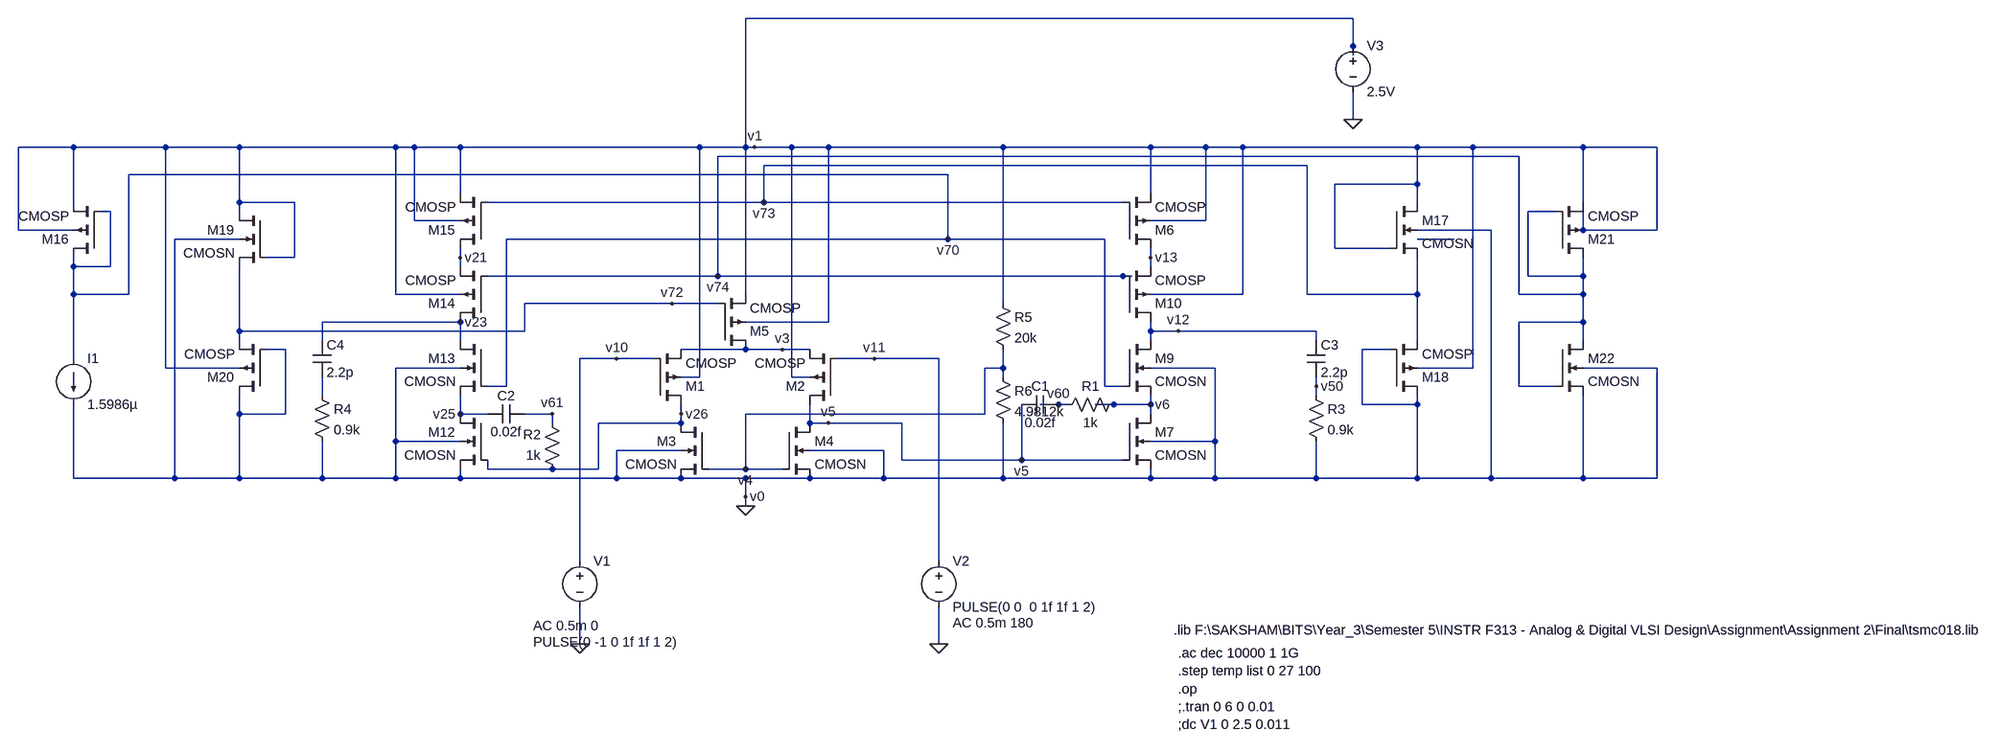
[diagram p0: schematic Circuit.asc]
Circuit.asc, the LTspice schematic file:
Version 4
SHEET 1 2412 744
WIRE 1264 -528 208 -528
WIRE 1264 -480 1264 -528
WIRE 1264 -464 1264 -480
WIRE 1264 -352 1264 -400
WIRE -960 -304 -1056 -304
WIRE -800 -304 -960 -304
WIRE -672 -304 -800 -304
WIRE -400 -304 -672 -304
WIRE -368 -304 -400 -304
WIRE -288 -304 -368 -304
WIRE 128 -304 -288 -304
WIRE 208 -304 208 -528
WIRE 208 -304 128 -304
WIRE 224 -304 208 -304
WIRE 288 -304 224 -304
WIRE 352 -304 288 -304
WIRE 656 -304 352 -304
WIRE 912 -304 656 -304
WIRE 1008 -304 912 -304
WIRE 1072 -304 1008 -304
WIRE 1376 -304 1072 -304
WIRE 1472 -304 1376 -304
WIRE 1664 -304 1472 -304
WIRE 1792 -304 1664 -304
WIRE 1552 -288 160 -288
WIRE 1184 -272 240 -272
WIRE 560 -256 -864 -256
WIRE 1376 -240 1376 -304
WIRE 1376 -240 1232 -240
WIRE -288 -224 -288 -304
WIRE 912 -224 912 -304
WIRE -960 -208 -960 -304
WIRE -672 -208 -672 -304
WIRE -576 -208 -672 -208
WIRE 240 -208 240 -272
WIRE 240 -208 -240 -208
WIRE 864 -208 240 -208
WIRE 1376 -208 1376 -240
WIRE 1664 -208 1664 -304
WIRE -896 -192 -912 -192
WIRE -672 -192 -672 -208
WIRE 1616 -192 1568 -192
WIRE -368 -176 -368 -304
WIRE -288 -176 -368 -176
WIRE 1008 -176 1008 -304
WIRE 1008 -176 912 -176
WIRE -1056 -160 -1056 -304
WIRE -960 -160 -1056 -160
WIRE 1504 -160 1376 -160
WIRE 1664 -160 1664 -192
WIRE 1792 -160 1792 -304
WIRE 1792 -160 1664 -160
WIRE -672 -144 -784 -144
WIRE 560 -144 560 -256
WIRE 560 -144 -208 -144
WIRE 832 -144 560 -144
WIRE 1440 -144 1376 -144
WIRE 1232 -128 1232 -240
WIRE 1328 -128 1232 -128
WIRE -576 -112 -576 -208
WIRE -576 -112 -624 -112
WIRE -288 -112 -288 -128
WIRE 912 -112 912 -128
WIRE -960 -96 -960 -112
WIRE -896 -96 -896 -192
WIRE -896 -96 -960 -96
WIRE -288 -96 -288 -112
WIRE 912 -96 912 -112
WIRE 160 -80 160 -288
WIRE 160 -80 -240 -80
WIRE 864 -80 160 -80
WIRE 880 -80 864 -80
WIRE 1568 -80 1568 -192
WIRE 1664 -80 1664 -112
WIRE 1664 -80 1568 -80
WIRE -960 -48 -960 -96
WIRE -864 -48 -864 -256
WIRE -864 -48 -960 -48
WIRE -400 -48 -400 -304
WIRE -288 -48 -400 -48
WIRE 208 -48 208 -304
WIRE 1072 -48 1072 -304
WIRE 1072 -48 912 -48
WIRE 1184 -48 1184 -272
WIRE 1376 -48 1376 -112
WIRE 1376 -48 1184 -48
WIRE 1552 -48 1552 -288
WIRE 1664 -48 1664 -80
WIRE 1664 -48 1552 -48
WIRE 80 -32 -176 -32
WIRE 160 -32 80 -32
WIRE 656 -32 656 -304
WIRE -288 0 -528 0
WIRE 352 0 352 -304
WIRE 352 0 208 0
WIRE 1664 0 1664 -48
WIRE 1664 0 1552 0
WIRE -672 16 -672 -96
WIRE -176 16 -176 -32
WIRE -176 16 -672 16
WIRE 912 16 912 0
WIRE 960 16 912 16
WIRE 1200 16 960 16
WIRE -672 32 -672 16
WIRE -528 32 -528 0
WIRE -288 32 -288 0
WIRE 912 32 912 16
WIRE 1200 32 1200 16
WIRE 1376 32 1376 -48
WIRE 1664 32 1664 0
WIRE -592 48 -624 48
WIRE 208 48 96 48
WIRE 272 48 208 48
WIRE 320 48 272 48
WIRE 1328 48 1280 48
WIRE -960 64 -960 -48
WIRE -16 64 -80 64
WIRE 48 64 -16 64
WIRE 432 64 368 64
WIRE 544 64 432 64
WIRE -800 80 -800 -304
WIRE -672 80 -800 80
WIRE -288 80 -400 80
WIRE 656 80 656 48
WIRE 656 80 624 80
WIRE 1024 80 912 80
WIRE 1472 80 1472 -304
WIRE 1472 80 1376 80
WIRE 1792 80 1664 80
WIRE 128 96 128 -304
WIRE 128 96 96 96
WIRE 288 96 288 -304
WIRE 320 96 288 96
WIRE 656 96 656 80
WIRE -208 112 -208 -144
WIRE -208 112 -240 112
WIRE 832 112 832 -144
WIRE 864 112 832 112
WIRE 1200 112 1200 96
WIRE 1552 112 1552 0
WIRE 1616 112 1552 112
WIRE -528 128 -528 96
WIRE 1200 128 1200 112
WIRE 752 144 720 144
WIRE 768 144 752 144
WIRE 848 144 816 144
WIRE 912 144 912 128
WIRE 912 144 848 144
WIRE 1280 144 1280 48
WIRE 1376 144 1376 128
WIRE 1376 144 1280 144
WIRE -672 160 -672 128
WIRE -592 160 -592 48
WIRE -592 160 -672 160
WIRE -288 160 -288 128
WIRE -240 160 -288 160
WIRE -128 160 -176 160
WIRE 96 160 96 144
WIRE 624 160 624 80
WIRE 624 160 208 160
WIRE 912 160 912 144
WIRE -128 176 -128 160
WIRE 96 176 96 160
WIRE 96 176 -48 176
WIRE 320 176 320 144
WIRE 352 176 320 176
WIRE 480 176 352 176
WIRE -400 208 -400 80
WIRE -288 208 -400 208
WIRE 1024 208 1024 80
WIRE 1024 208 912 208
WIRE 96 224 -16 224
WIRE 448 224 320 224
WIRE 480 240 480 176
WIRE 688 240 688 144
WIRE 688 240 480 240
WIRE 864 240 688 240
WIRE -240 256 -240 240
WIRE -128 256 -240 256
WIRE -48 256 -48 176
WIRE -48 256 -128 256
WIRE 208 256 208 160
WIRE 208 256 144 256
WIRE 272 256 208 256
WIRE -960 272 -960 144
WIRE -784 272 -784 -144
WIRE -784 272 -960 272
WIRE -672 272 -672 160
WIRE -672 272 -784 272
WIRE -528 272 -528 208
WIRE -528 272 -672 272
WIRE -400 272 -400 208
WIRE -400 272 -528 272
WIRE -288 272 -288 256
WIRE -288 272 -400 272
WIRE -16 272 -16 224
WIRE -16 272 -288 272
WIRE 96 272 -16 272
WIRE 208 272 96 272
WIRE 320 272 208 272
WIRE 448 272 448 224
WIRE 448 272 320 272
WIRE 656 272 656 176
WIRE 656 272 448 272
WIRE 912 272 912 256
WIRE 912 272 656 272
WIRE 1024 272 1024 208
WIRE 1024 272 912 272
WIRE 1200 272 1200 208
WIRE 1200 272 1024 272
WIRE 1376 272 1376 144
WIRE 1376 272 1200 272
WIRE 1504 272 1504 -160
WIRE 1504 272 1376 272
WIRE 1664 272 1664 128
WIRE 1664 272 1504 272
WIRE 1792 272 1792 80
WIRE 1792 272 1664 272
WIRE 208 304 208 272
WIRE 208 320 208 304
WIRE -80 416 -80 64
WIRE 544 416 544 64
WIRE -80 560 -80 496
WIRE 544 560 544 496
FLAG 208 320 0
FLAG 1264 -352 0
FLAG 544 560 0
FLAG -80 560 0
FLAG 960 16 v12
FLAG 272 48 v3
FLAG 80 -32 v72
FLAG 96 160 v26
FLAG -16 64 v10
FLAG 224 -304 v1
FLAG 352 176 v5
FLAG 432 64 v11
FLAG 208 256 v4
FLAG 912 -112 v13
FLAG 912 144 v6
FLAG 688 240 v5
FLAG 560 -144 v70
FLAG -288 -112 v21
FLAG -288 0 v23
FLAG -288 160 v25
FLAG 752 144 v60
FLAG -128 160 v61
FLAG 1200 112 v50
FLAG 208 304 v0
FLAG 240 -208 v73
FLAG 160 -80 v74
SYMBOL pmos4 48 144 M180
SYMATTR InstName M1
SYMATTR Value CMOSP
SYMATTR Value2 l=350n w=122500n
SYMBOL pmos4 368 144 R180
SYMATTR InstName M2
SYMATTR Value CMOSP
SYMATTR Value2 l=350n w=122500n
SYMBOL pmos4 160 48 M180
SYMATTR InstName M5
SYMATTR Value CMOSP
SYMATTR Value2 l=350n w=1750n
SYMBOL voltage -80 400 R0
WINDOW 3 -81 157 Left 2
WINDOW 123 -81 129 Left 2
WINDOW 39 0 0 Left 2
SYMATTR Value PULSE(0 -1 0 1f 1f 1 2)
SYMATTR Value2 AC 0.5m 0
SYMATTR InstName V1
SYMBOL voltage 544 400 R0
WINDOW 123 24 124 Left 2
WINDOW 39 0 0 Left 2
SYMATTR Value2 AC 0.5m 180
SYMATTR InstName V2
SYMATTR Value PULSE(0 0  0 1f 1f 1 2)
SYMBOL pmos4 864 -128 M180
SYMATTR InstName M6
SYMATTR Value CMOSP
SYMATTR Value2 l=350n w=3300n
SYMBOL pmos4 864 0 M180
SYMATTR InstName M10
SYMATTR Value CMOSP
SYMATTR Value2 l=350n w=3300n
SYMBOL pmos4 -240 0 R180
SYMATTR InstName M14
SYMATTR Value CMOSP
SYMATTR Value2 l=350n w=3300n
SYMBOL pmos4 -240 -128 R180
SYMATTR InstName M15
SYMATTR Value CMOSP
SYMATTR Value2 l=350n w=3300n
SYMBOL nmos4 144 176 M0
SYMATTR InstName M3
SYMATTR Value CMOSN
SYMATTR Value2 l=350n w=35000n
SYMBOL nmos4 272 176 R0
SYMATTR InstName M4
SYMATTR Value CMOSN
SYMATTR Value2 l=350n w=35000n
SYMBOL nmos4 864 160 R0
SYMATTR InstName M7
SYMATTR Value CMOSN
SYMATTR Value2 l=350n w=70000n
SYMBOL nmos4 864 32 R0
SYMATTR InstName M9
SYMATTR Value CMOSN
SYMATTR Value2 l=350n w=2000n
SYMBOL nmos4 -240 160 M0
SYMATTR InstName M12
SYMATTR Value CMOSN
SYMATTR Value2 l=350n w=70000n
SYMBOL nmos4 -240 32 M0
SYMATTR InstName M13
SYMATTR Value CMOSN
SYMATTR Value2 l=350n w=2000n
SYMBOL cap 752 128 R90
WINDOW 0 0 32 VBottom 2
WINDOW 3 32 32 VTop 2
SYMATTR InstName C1
SYMATTR Value 0.02f
SYMBOL cap -176 144 R90
WINDOW 0 0 32 VBottom 2
WINDOW 3 32 32 VTop 2
SYMATTR InstName C2
SYMATTR Value 0.02f
SYMBOL res 864 128 R90
WINDOW 0 0 56 VBottom 2
WINDOW 3 32 56 VTop 2
SYMATTR InstName R1
SYMATTR Value 1k
SYMBOL res -112 272 R180
WINDOW 0 36 76 Left 2
WINDOW 3 36 40 Left 2
SYMATTR InstName R2
SYMATTR Value 1k
SYMBOL cap 1184 32 R0
SYMATTR InstName C3
SYMATTR Value 2.2p
SYMBOL cap -544 32 R0
SYMATTR InstName C4
SYMATTR Value 2.2p
SYMBOL pmos4 -912 -112 R180
SYMATTR InstName M16
SYMATTR Value CMOSP
SYMATTR Value2 l=350n w=350n
SYMBOL nmos4 1328 -208 R0
SYMATTR InstName M17
SYMATTR Value CMOSN
SYMATTR Value2 l=350n w=1920n
SYMBOL pmos4 1328 128 M180
SYMATTR InstName M18
SYMATTR Value CMOSP
SYMATTR Value2 l=350n w=350n
SYMBOL nmos4 -624 -192 M0
SYMATTR InstName M19
SYMATTR Value CMOSN
SYMATTR Value2 l=350n w=877n
SYMBOL pmos4 -624 128 R180
SYMATTR InstName M20
SYMATTR Value CMOSP
SYMATTR Value2 l=350n w=350n
SYMBOL pmos4 1616 -112 M180
SYMATTR InstName M21
SYMATTR Value CMOSP
SYMATTR Value2 l=350n w=573n
SYMBOL current -960 64 R0
WINDOW 123 0 0 Left 2
WINDOW 39 0 0 Left 2
SYMATTR InstName I1
SYMATTR Value 1.5986µ
SYMBOL nmos4 1616 32 R0
SYMATTR InstName M22
SYMATTR Value CMOSN
SYMATTR Value2 l=350n w=350n
SYMBOL res 1184 112 R0
SYMATTR InstName R3
SYMATTR Value 0.9k
SYMBOL res -544 112 R0
SYMATTR InstName R4
SYMATTR Value 0.9k
SYMBOL res 640 -48 R0
SYMATTR InstName R5
SYMATTR Value 20k
SYMBOL res 640 80 R0
SYMATTR InstName R6
SYMATTR Value 4.9812k
SYMBOL voltage 1264 -496 R0
WINDOW 123 0 0 Left 2
WINDOW 39 0 0 Left 2
SYMATTR InstName V3
SYMATTR Value 2.5V
TEXT 952 536 Left 2 !.lib F:\\SAKSHAM\\BITS\\Year_3\\Semester 5\\INSTR F313 - Analog & Digital VLSI Design\\Assignment\\Assignment 2\\Final\\tsmc018.lib
TEXT 960 576 Left 2 !.ac dec 10000 1 1G\n.step temp list 0 27 100\n.op\n;.tran 0 6 0 0.01\n;dc V1 0 2.5 0.011

The netlist it stands for:
* Circuit.asc
M1 v26 v10 v3 v1 CMOSP l=350n w=122500n
M2 v5 v11 v3 v1 CMOSP l=350n w=122500n
M5 v3 v72 v1 v1 CMOSP l=350n w=1750n
V1 v10 0 PULSE(0 -1 0 1f 1f 1 2) AC 0.5m 0
V2 v11 0 PULSE(0 0  0 1f 1f 1 2) AC 0.5m 180
M6 v13 v73 v1 v1 CMOSP l=350n w=3300n
M10 v12 v74 v13 v1 CMOSP l=350n w=3300n
M14 v23 v74 v21 v1 CMOSP l=350n w=3300n
M15 v21 v73 v1 v1 CMOSP l=350n w=3300n
M3 v26 v4 0 0 CMOSN l=350n w=35000n
M4 v5 v4 0 0 CMOSN l=350n w=35000n
M7 v6 v5 0 0 CMOSN l=350n w=70000n
M9 v12 v70 v6 0 CMOSN l=350n w=2000n
M12 v25 v26 0 0 CMOSN l=350n w=70000n
M13 v23 v70 v25 0 CMOSN l=350n w=2000n
C1 v60 v5 0.02f
C2 v61 v25 0.02f
R1 v6 v60 1k
R2 v26 v61 1k
C3 v12 v50 2.2p
C4 v23 N002 2.2p
M16 v70 v70 v1 v1 CMOSP l=350n w=350n
M17 v1 v1 v73 0 CMOSN l=350n w=1920n
M18 0 0 v73 v1 CMOSP l=350n w=350n
M19 v1 v1 v72 0 CMOSN l=350n w=877n
M20 0 0 v72 v1 CMOSP l=350n w=350n
M21 v74 v74 v1 v1 CMOSP l=350n w=573n
I1 v70 0 1.5986µ
M22 v74 v74 0 0 CMOSN l=350n w=350n
R3 v50 0 0.9k
R4 N002 0 0.9k
R5 v1 v4 20k
R6 v4 0 4.9812k
V3 v1 0 2.5V
.model NMOS NMOS
.model PMOS PMOS
.lib standard.mos
.lib F:\SAKSHAM\BITS\Year_3\Semester 5\INSTR F313 - Analog & Digital VLSI Design\Assignment\Assignment 2\Final\tsmc018.lib
.ac dec 10000 1 1G
.step temp list 0 27 100
.op
;.tran 0 6 0 0.01
;dc V1 0 2.5 0.011
.backanno
.end

* Results of the author's LTspice run, read from the files saved beside the schematic
* Operating Point (first step), zero values left out:
*   V(v26) = 1.993 V
*   V(v3) = 1.993 V
*   V(v1) = 2.5 V
*   V(v5) = 1.993 V
*   V(v72) = 1.426 V
*   V(v13) = 2.104 V
*   V(v73) = 1.483 V
*   V(v12) = 52.03 mV
*   V(v74) = 1.115 V
*   V(v23) = 52.03 mV
*   V(v21) = 2.104 V
*   V(v4) = 498.5 mV
*   V(v6) = 1.336 mV
*   V(v70) = 1.789 V
*   V(v25) = 1.336 mV
*   V(v60) = 1.336 mV
*   V(v61) = 1.993 V
*   Id(M22) = 38.88 µA
*   Ib(M22) = -1.125 pA
*   Is(M22) = -38.88 µA
*   Id(M19) = 16.19 µA
*   Ib(M19) = -3.946 pA
*   Is(M19) = -16.19 µA
*   Id(M17) = 18.94 µA
*   Ib(M17) = -4.003 pA
*   Is(M17) = -18.94 µA
*   Id(M13) = 70.68 µA
*   Is(M13) = -70.68 µA
*   Id(M12) = 70.68 µA
*   Is(M12) = -70.68 µA
*   Id(M9) = 70.68 µA
*   Is(M9) = -70.68 µA
*   Id(M7) = 70.68 µA
*   Is(M7) = -70.68 µA
*   Id(M4) = 23.47 µA
*   Ib(M4) = -2.003 pA
*   Is(M4) = -23.47 µA
*   Id(M3) = 23.47 µA
*   Ib(M3) = -2.003 pA
*   Is(M3) = -23.47 µA
*   Id(M21) = -38.88 µA
*   Ib(M21) = 1.395 pA
*   Is(M21) = 38.88 µA
*   Id(M20) = -16.19 µA
*   Ib(M20) = 3.594 pA
*   Is(M20) = 16.19 µA
*   Id(M18) = -18.94 µA
*   Ib(M18) = 3.537 pA
*   Is(M18) = 18.94 µA
*   Id(M16) = -1.599 µA
*   Is(M16) = 1.599 µA
*   Id(M15) = -70.68 µA
*   Is(M15) = 70.68 µA
*   Id(M14) = -70.68 µA
*   Ib(M14) = 2.864 pA
*   Is(M14) = 70.68 µA
*   Id(M10) = -70.68 µA
*   Ib(M10) = 2.864 pA
*   Is(M10) = 70.68 µA
*   Id(M6) = -70.68 µA
*   Is(M6) = 70.68 µA
*   Id(M5) = -46.95 µA
*   Is(M5) = 46.95 µA
*   Id(M2) = -23.47 µA
*   Ib(M2) = 1.034 pA
*   Is(M2) = 23.47 µA
*   Id(M1) = -23.47 µA
*   Ib(M1) = 1.034 pA
*   Is(M1) = 23.47 µA
*   I(I1) = 1.599 µA
*   I(R6) = 100.1 µA
*   I(R5) = 100.1 µA
*   I(V3) = -364 µA
* From the log:
*   Semiconductor Device Operating Points:
*                           --- BSIM3 MOSFETS ---
*   Name:        m22         m19         m17         m13         m12
*   Model:      cmosn       cmosn       cmosn       cmosn       cmosn
*   Id:        3.89e-05    1.62e-05    1.89e-05    7.07e-05    7.07e-05
*   Vgs:       1.12e+00    1.07e+00    1.02e+00    1.79e+00    1.99e+00
*   Vds:       1.12e+00    1.07e+00    1.02e+00    5.07e-02    1.34e-03
*   Vbs:       0.00e+00   -1.43e+00   -1.48e+00   -1.34e-03    0.00e+00
*   Vth:       5.60e-01    8.72e-01    8.82e-01    5.63e-01    5.62e-01
*   Vdsat:     4.09e-01    1.90e-01    1.42e-01    8.03e-01    9.22e-01
*   Gm:        1.02e-04    1.23e-04    2.01e-04    2.22e-05    1.33e-05
*   Gds:       3.93e-06    2.84e-06    3.96e-06    1.35e-03    5.29e-02
*   Gmb        3.47e-05    2.52e-05    3.93e-05    2.28e-05    2.04e-05
*   Cbd:       0.00e+00    0.00e+00    0.00e+00    0.00e+00    0.00e+00
*   Cbs:       0.00e+00    0.00e+00    0.00e+00    0.00e+00    0.00e+00
*   Cgsov:     1.91e-16    4.78e-16    1.05e-15    1.09e-15    3.82e-14
*   Cgdov:     1.89e-16    4.73e-16    1.04e-15    1.09e-15    3.82e-14
*   Cgbov:     0.00e+00    0.00e+00    0.00e+00    0.00e+00    0.00e+00
*   dQgdVgb:   1.05e-15    2.62e-15    5.71e-15    6.77e-15    2.37e-13
*   dQgdVdb:  -1.88e-16   -4.70e-16   -1.03e-15   -3.27e-15   -1.17e-13
*   dQgdVsb:  -8.19e-16   -2.07e-15   -4.50e-15   -3.46e-15   -1.18e-13
*   dQddVgb:  -1.90e-16   -4.74e-16   -1.04e-15   -3.37e-15   -1.18e-13
*   dQddVdb:   1.89e-16    4.73e-16    1.04e-15    7.36e-15    2.66e-13
*   dQddVsb:   3.53e-19    8.30e-19    1.97e-18   -3.36e-15   -1.24e-13
*   dQbdVgb:  -1.31e-16   -3.16e-16   -6.92e-16   -1.28e-17   -2.64e-16
*   dQbdVdb:  -5.89e-20   -9.65e-20   -1.64e-19   -2.00e-15   -7.25e-14
*   dQbdVsb:  -6.66e-17   -5.53e-18   -2.34e-18    6.59e-16    2.49e-14
*   Name:        m9          m7          m4          m3          m21
*   Model:      cmosn       cmosn       cmosn       cmosn       cmosp
*   Id:        7.07e-05    7.07e-05    2.35e-05    2.35e-05   -3.89e-05
*   Vgs:       1.79e+00    1.99e+00    4.98e-01    4.98e-01   -1.38e+00
*   Vds:       5.07e-02    1.34e-03    1.99e+00    1.99e+00   -1.38e+00
*   Vbs:      -1.34e-03    0.00e+00    0.00e+00    0.00e+00    0.00e+00
*   Vth:       5.63e-01    5.62e-01    5.58e-01    5.58e-01   -5.14e-01
*   Vdsat:     8.03e-01    9.22e-01    4.73e-02    4.73e-02   -5.12e-01
*   Gm:        2.22e-05    1.33e-05    5.30e-04    5.30e-04    6.71e-05
*   Gds:       1.35e-03    5.29e-02    6.66e-06    6.66e-06    7.84e-06
*   Gmb        2.28e-05    2.04e-05    1.57e-04    1.57e-04    1.66e-05
*   Cbd:       0.00e+00    0.00e+00    0.00e+00    0.00e+00    0.00e+00
*   Cbs:       0.00e+00    0.00e+00    0.00e+00    0.00e+00    0.00e+00
*   Cgsov:     1.09e-15    3.82e-14    1.91e-14    1.91e-14    3.12e-16
*   Cgdov:     1.09e-15    3.82e-14    1.67e-14    1.67e-14    3.09e-16
*   Cgbov:     0.00e+00    0.00e+00    0.00e+00    0.00e+00    0.00e+00
*   dQgdVgb:   6.77e-15    2.37e-13    6.04e-14    6.04e-14    1.77e-15
*   dQgdVdb:  -3.27e-15   -1.17e-13   -1.67e-14   -1.67e-14   -3.09e-16
*   dQgdVsb:  -3.46e-15   -1.18e-13   -2.58e-14   -2.58e-14   -1.41e-15
*   dQddVgb:  -3.37e-15   -1.18e-13   -1.67e-14   -1.67e-14   -3.09e-16
*   dQddVdb:   7.36e-15    2.66e-13    1.67e-14    1.67e-14    3.09e-16
*   dQddVsb:  -3.36e-15   -1.24e-13    1.10e-18    1.10e-18    2.12e-19
*   dQbdVgb:  -1.28e-17   -2.64e-16   -1.87e-14   -1.87e-14   -2.50e-16
*   dQbdVdb:  -2.00e-15   -7.25e-14    1.34e-18    1.34e-18   -3.10e-19
*   dQbdVsb:   6.59e-16    2.49e-14   -9.40e-16   -9.40e-16   -4.79e-17
*   Name:        m20         m18         m16         m15         m14
*   Model:      cmosp       cmosp       cmosp       cmosp       cmosp
*   Id:       -1.62e-05   -1.89e-05   -1.60e-06   -7.07e-05   -7.07e-05
*   Vgs:      -1.43e+00   -1.48e+00   -7.11e-01   -1.02e+00   -9.88e-01
*   Vds:      -1.43e+00   -1.48e+00   -7.11e-01   -3.96e-01   -2.05e+00
*   Vbs:       1.07e+00    1.02e+00    0.00e+00    0.00e+00    3.96e-01
*   Vth:      -7.39e-01   -7.29e-01   -5.14e-01   -5.14e-01   -6.09e-01
*   Vdsat:    -4.62e-01   -4.97e-01   -1.51e-01   -3.30e-01   -2.75e-01
*   Gm:        3.64e-05    3.82e-05    1.55e-05    2.28e-04    3.00e-04
*   Gds:       3.22e-06    3.60e-06    5.92e-07    3.86e-05    1.53e-05
*   Gmb        7.23e-06    7.79e-06    3.85e-06    5.65e-05    6.69e-05
*   Cbd:       0.00e+00    0.00e+00    0.00e+00    0.00e+00    0.00e+00
*   Cbs:       0.00e+00    0.00e+00    0.00e+00    0.00e+00    0.00e+00
*   Cgsov:     1.91e-16    1.91e-16    1.91e-16    1.80e-15    1.80e-15
*   Cgdov:     1.88e-16    1.88e-16    1.88e-16    1.80e-15    1.61e-15
*   Cgbov:     0.00e+00    0.00e+00    0.00e+00    0.00e+00    0.00e+00
*   dQgdVgb:   1.07e-15    1.07e-15    1.09e-15    1.03e-14    9.99e-15
*   dQgdVdb:  -1.89e-16   -1.89e-16   -1.89e-16   -1.87e-15   -1.61e-15
*   dQgdVsb:  -8.41e-16   -8.41e-16   -8.47e-16   -8.02e-15   -7.96e-15
*   dQddVgb:  -1.89e-16   -1.89e-16   -1.89e-16   -1.97e-15   -1.61e-15
*   dQddVdb:   1.89e-16    1.89e-16    1.89e-16    2.06e-15    1.61e-15
*   dQddVsb:   1.63e-19    1.46e-19    7.62e-19   -5.52e-17    8.94e-19
*   dQbdVgb:  -1.40e-16   -1.41e-16   -1.55e-16   -1.39e-15   -1.39e-15
*   dQbdVdb:  -1.06e-19   -1.09e-19   -1.67e-19   -9.52e-17   -1.19e-19
*   dQbdVsb:   4.80e-18    3.70e-18   -4.21e-17   -3.22e-16   -1.70e-16
*   Name:        m10         m6          m5          m2          m1
*   Model:      cmosp       cmosp       cmosp       cmosp       cmosp
*   Id:       -7.07e-05   -7.07e-05   -4.69e-05   -2.35e-05   -2.35e-05
*   Vgs:      -9.88e-01   -1.02e+00   -1.07e+00   -1.99e+00   -1.99e+00
*   Vds:      -2.05e+00   -3.96e-01   -5.07e-01   -7.96e-04   -7.96e-04
*   Vbs:       3.96e-01    0.00e+00    0.00e+00    5.07e-01    5.07e-01
*   Vth:      -6.09e-01   -5.14e-01   -5.14e-01   -6.32e-01   -6.32e-01
*   Vdsat:    -2.75e-01   -3.30e-01   -3.60e-01   -7.71e-01   -7.71e-01
*   Gm:        3.00e-04    2.28e-04    1.36e-04    1.13e-05    1.13e-05
*   Gds:       1.53e-05    3.86e-05    1.86e-05    2.95e-02    2.95e-02
*   Gmb        6.69e-05    5.65e-05    3.36e-05    4.41e-06    4.41e-06
*   Cbd:       0.00e+00    0.00e+00    0.00e+00    0.00e+00    0.00e+00
*   Cbs:       0.00e+00    0.00e+00    0.00e+00    0.00e+00    0.00e+00
*   Cgsov:     1.80e-15    1.80e-15    9.53e-16    6.67e-14    6.67e-14
*   Cgdov:     1.61e-15    1.80e-15    9.52e-16    6.67e-14    6.67e-14
*   Cgbov:     0.00e+00    0.00e+00    0.00e+00    0.00e+00    0.00e+00
*   dQgdVgb:   9.99e-15    1.03e-14    5.44e-15    4.21e-13    4.21e-13
*   dQgdVdb:  -1.61e-15   -1.87e-15   -9.71e-16   -2.08e-13   -2.08e-13
*   dQgdVsb:  -7.96e-15   -8.02e-15   -4.27e-15   -2.06e-13   -2.06e-13
*   dQddVgb:  -1.61e-15   -1.97e-15   -9.97e-16   -2.10e-13   -2.10e-13
*   dQddVdb:   1.61e-15    2.06e-15    1.02e-15    5.10e-13    5.10e-13
*   dQddVsb:   8.94e-19   -5.52e-17   -9.31e-18   -2.70e-13   -2.70e-13
*   dQbdVgb:  -1.39e-15   -1.39e-15   -7.53e-16   -3.67e-16   -3.67e-16
*   dQbdVdb:  -1.19e-19   -9.52e-17   -2.31e-17   -1.54e-13   -1.54e-13
*   dQbdVsb:  -1.70e-16   -3.22e-16   -1.72e-16    8.73e-14    8.73e-14